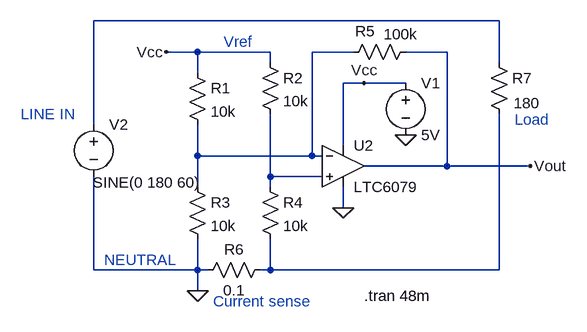
[diagram p0: schematic ISENSE.asc]
ISENSE.asc, the LTspice schematic file:
Version 4
SHEET 1 880 680
WIRE 448 -80 -176 -80
WIRE -16 -32 -64 -32
WIRE 96 -32 -16 -32
WIRE 224 -32 160 -32
WIRE 368 -32 304 -32
WIRE 96 -16 96 -32
WIRE 448 -16 448 -80
WIRE -16 0 -16 -32
WIRE 240 16 208 16
WIRE 304 16 240 16
WIRE -176 80 -176 -80
WIRE 208 112 208 16
WIRE -16 128 -16 80
WIRE 160 128 160 -32
WIRE 160 128 -16 128
WIRE 176 128 160 128
WIRE 368 144 368 -32
WIRE 368 144 240 144
WIRE 496 144 368 144
WIRE 96 160 96 64
WIRE 176 160 96 160
WIRE -16 176 -16 128
WIRE 96 176 96 160
WIRE 208 208 208 176
WIRE -176 304 -176 160
WIRE -16 304 -16 256
WIRE -16 304 -176 304
WIRE 0 304 -16 304
WIRE 96 304 96 256
WIRE 96 304 80 304
WIRE 448 304 448 64
WIRE 448 304 96 304
WIRE -16 336 -16 304
FLAG -16 336 0
FLAG 208 208 0
FLAG 304 96 0
FLAG -64 -32 Vcc
FLAG 496 144 Vout
FLAG 240 16 Vcc
SYMBOL Opamps\\LTC6079 208 144 R0
SYMATTR InstName U2
SYMBOL res -32 -16 R0
SYMATTR InstName R1
SYMATTR Value 10k
SYMBOL res -32 160 R0
SYMATTR InstName R3
SYMATTR Value 10k
SYMBOL res 80 160 R0
SYMATTR InstName R4
SYMATTR Value 10k
SYMBOL res 320 -48 R90
WINDOW 0 0 78 VBottom 0
WINDOW 3 -27 23 VTop 0
SYMATTR InstName R5
SYMATTR Value 100k
SYMBOL res 96 288 R90
WINDOW 0 0 56 VBottom 0
WINDOW 3 32 56 VTop 0
SYMATTR InstName R6
SYMATTR Value 0.1
SYMBOL res 432 -32 R0
WINDOW 3 38 79 Left 0
SYMATTR Value 180
SYMATTR InstName R7
SYMBOL voltage 304 0 R0
WINDOW 123 0 0 Left 0
WINDOW 39 0 0 Left 0
SYMATTR InstName V1
SYMATTR Value 5V
SYMBOL voltage -176 64 R0
WINDOW 3 -1 105 Left 0
WINDOW 123 0 0 Left 0
WINDOW 39 0 0 Left 0
SYMATTR Value SINE(0 180 60)
SYMATTR InstName V2
SYMBOL res 80 -32 R0
SYMATTR InstName R2
SYMATTR Value 10k
TEXT 240 344 Left 0 !.tran 48m
TEXT -288 64 Left 0 ;LINE IN
TEXT 24 -48 Left 0 ;Vref
TEXT 8 352 Left 0 ;Current sense
TEXT 472 72 Left 0 ;Load
TEXT -160 288 Left 0 ;NEUTRAL

The netlist it stands for:
* ISENSE.asc
XU2 N003 N002 Vcc 0 Vout LTC6078  ; LTC6079, pins In+ In- V+ V- OUT
R1 Vcc N002 10k
R3 N002 0 10k
R4 N003 N004 10k
R5 Vout N002 100k
R6 N004 0 0.1
R7 N001 N004 180
V1 Vcc 0 5V
V2 N001 0 SINE(0 180 60)
R2 Vcc N003 10k
.tran 48m
* LINE IN
* Vref
* Current sense
* Load
* NEUTRAL
.lib LTC5.lib
.backanno
.end